# Altium schematic sheet Microswitch_Interface.SchDoc: Microswitch Interface
size A4; DrawnBy: Samyar Sadat Akhavi; Revision: 1.0; SheetNumber: 7; SheetTotal: 14
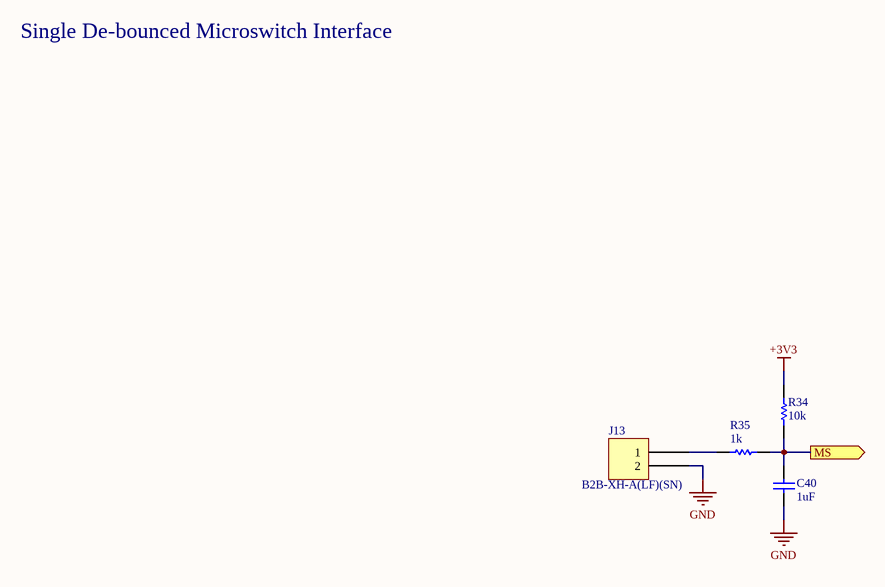
[diagram p0: Microswitch_Interface.SchDoc]

## Parts
?  (no value)  (graphical)
C40  1uF  [CAP_SMD_603]
J13  B2B-XH-A(LF)(SN)  [JST XH B2B-XH-A]
R34  10k  [RES_0603]
R35  1k  [RES_0603]

## Ports
MS (out, see Sensors_IO[4A])

## Nets
+3V3: R34.1
GND: C40.2 J13.2
MS: C40.1 R34.2 R35.1 ; port MS
NetJ13_1: J13.1 R35.2

## Notes on the sheet
- Single De-bounced Microswitch Interface
- Sub-Project:
- Size:
- Drawn By:
- Revision:
- Date:
- File:
- Sheet:
- of

## Library data of the parts
? = Standard Title Block
C40 = Non-polar Capacitor: Generic Ceramic Capacitor; Voltage: 6.3V; Value: 1uF
J13 = B2B-XH-A(LF)(SN): CONN HEADER VERT 2POS 2.5MM; Manufacturer: JST Sales America Inc.; Contact Length - Post: 0.134" (3.40mm); Current Rating (Amps): 3A; Material Flammability Rating: UL94 V-0; Number of Positions: 2; Number of Positions Loaded: All; Pitch - Mating: 0.098" (2.50mm); Shrouding: Shrouded - 4 Wall; Style: Board to Cable/Wire; Voltage Rating: 250V; Part Number: B2B-XH-A(LF)(SN); ComponentLink1Description: Datasheet; ComponentLink1URL: http://www.jst-mfg.com/product/pdf/eng/eXH.pdf; ComponentLink2Description: DigiKey Link; ComponentLink2URL: http://digikey.com/product-detail/en/jst-sales-america-inc/B2B-XH-A-LF-SN/455-2247-ND/1651045; Connector Type: Header; Contact Finish - Mating: Tin; Contact Finish - Post: Tin; Contact Material: Brass; Contact Shape: Square; Contact Type: Male Pin; Fastening Type: Detent Lock; Insulation Color: Natural; Insulation Height: 0.276" (7.00mm); Insulation Material: Polyamide (PA66), Nylon 6/6; LastUpdated: 1/12/2020 11:46:08 PM; Lifecycle Status: Active; Minimum Order: 1; Mounting Type: Through Hole; Number of Rows: 1; Operating Temperature: -25°C ~ 85°C; Packaging: Bulk; PartId: 67; Part Status: Active; Price: 0.15; Series: XH; Supplier 1: DigiKey; Supplier Part Number 1: 455-2247-ND; Termination: Press-Fit, Solder
R34 R35 = Resistor: Power: 1/8W
  R34: Value: 10k
  R35: Value: 1k